# EAGLE design heatbed (EAGLE 6.5.0)
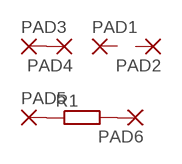
[diagram p0: schematic, sheet 1]

## Parts
PAD1  SMD5  [SMD2,54-5,08]
PAD2  SMD5  [SMD2,54-5,08]
PAD3  SMD5  [SMD2,54-5,08]
PAD4  SMD5  [SMD2,54-5,08]
PAD5  SMD5  [SMD2,54-5,08]
PAD6  SMD5  [SMD2,54-5,08]
R1  R-EU_R0805  [R0805]

## Nets
N$1: PAD5.1(P) R1.1
N$2: PAD6.1(P) R1.2
N$3: PAD3.1(P) PAD4.1(P)
Unconnected: PAD1.1(P) PAD2.1(P)

## Library data of the parts
PAD1-PAD6 = wirepad:SMD5: SMD PAD
R1 = rcl:R-EU_: RESISTOR, European symbol

## Board
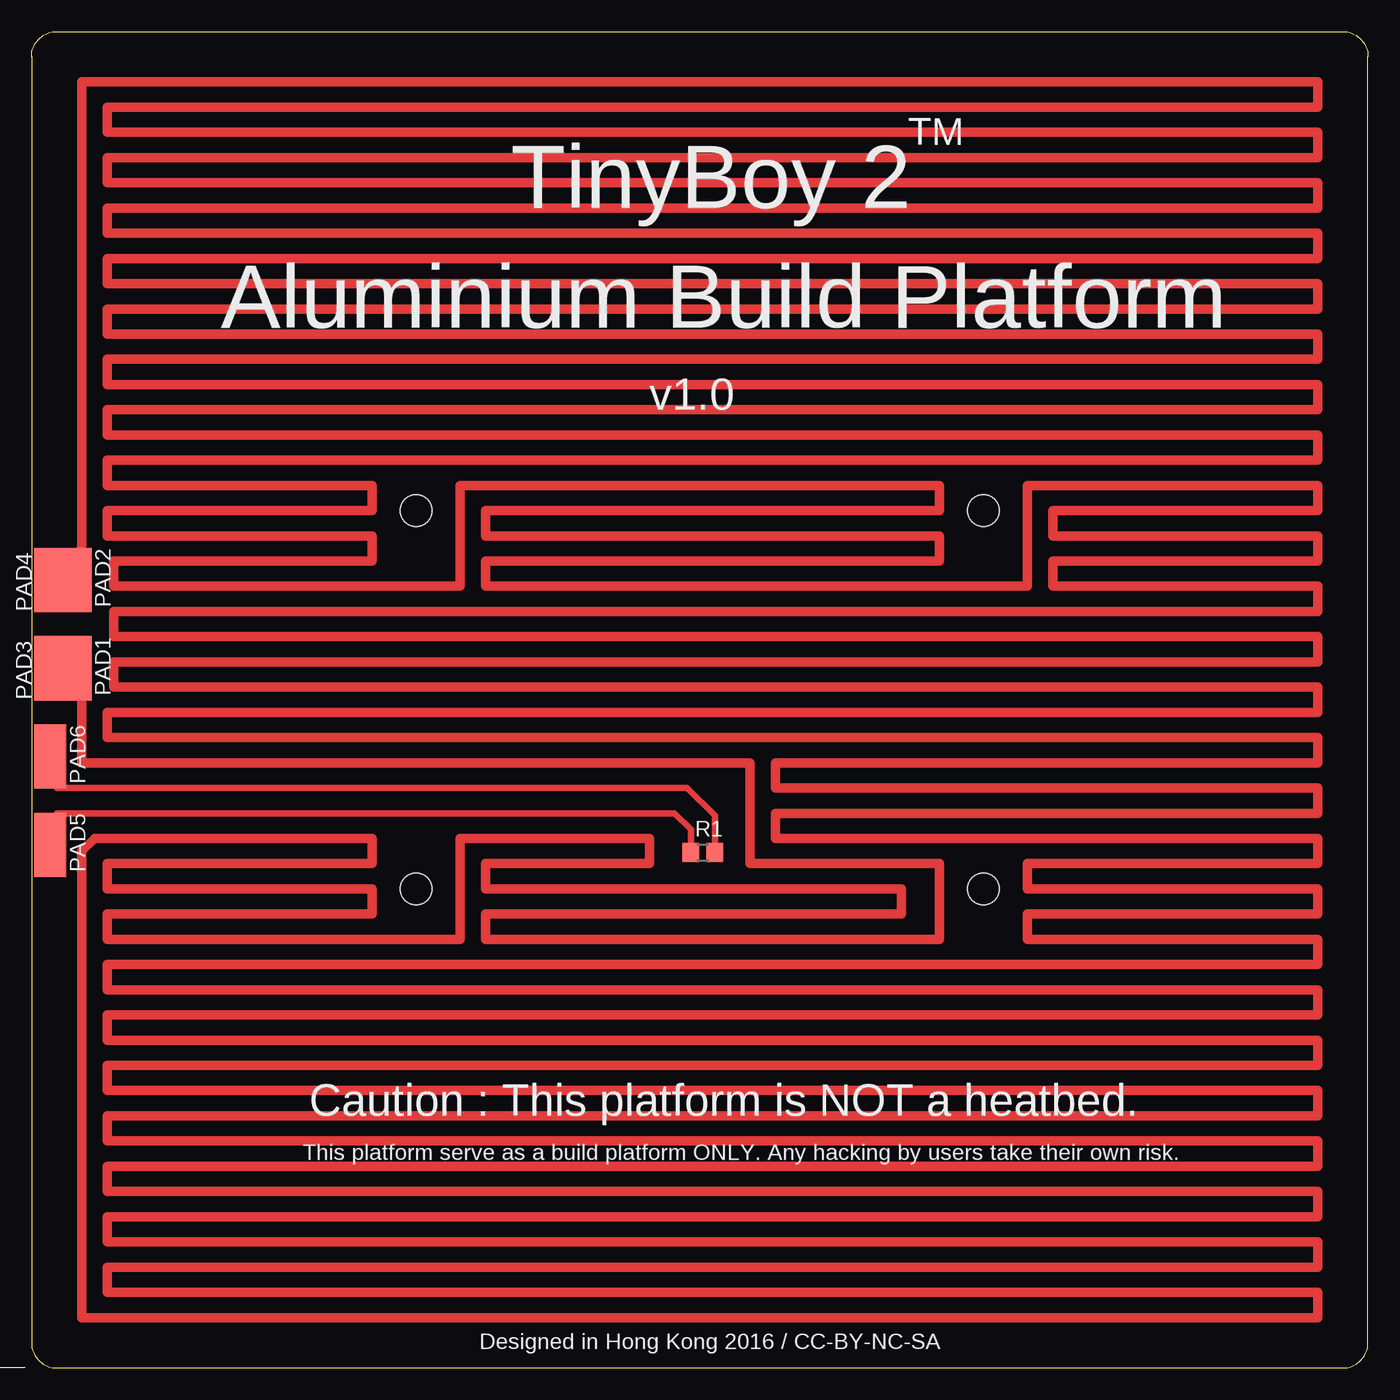
[diagram p1: board, top side]

Size 106 x 106 mm. Coordinates in mm from the lower left corner, seen from the top.
Outline: 0,104 0,2 arc90 2,0 104,0 arc90 106,2 106,104 arc90 104,106 2,106 arc90 0,104
Copper layers (1*16): Top 0.035mm / dielectric 1.5mm / Bottom 0.035mm
Design rules "default": minimum track width 10mil, minimum drill 24mil, track to track 8mil, track to pad 8mil, pad to pad 8mil, via to via 8mil, smd to smd 8mil, copper to edge 40mil, drill to drill 8mil, minimum pad ring 10mil, minimum via ring 8mil, stop-mask expansion 4mil, vias tented up to drill 0mil, thermal gap 10mil
Holes 2.5 mm at 30.5,68 75.5,68 75.5,38 30.5,38

### Footprints (pad centres in the part's own frame; a part is rotated, then mirrored left to right if it is on the bottom)
SMD2,54-5,08 = smd 2.54 x 5.08: 1 0,0
R0805 = smd 1.3 x 1.5: 1 -0.95,0; 2 0.95,0

### Placement (x,y rotation side)
PAD1  3.5,55.5 180 top
PAD2  3.5,62.5 180 top
PAD3  1.5,55.5 0 top
PAD4  1.5,62.5 0 top
PAD5  1.5,41.5 180 top
PAD6  1.5,48.5 180 top
R1  53.24,40.89 0 top

### Tracks (layer width: path | path; a pad name or v marks a point on that pad's centre or on a via)
N$1
  Top 0.5: R1.1 52.29,42.71 51,44 2,44 2,41 PAD5.1
N$2
  Top 0.5: R1.2 54.19,43.81 52,46 2,46 1,47 1,48 PAD6.1
N$3
  Top 0.75: PAD4.1 3.5,62.5 4,63 4,102 102,102 102,100 6,100 6,98 102,98 102,96 6,96 6,94 102,94 102,92 6,92 6,90 102,90 102,88 6,88 6,86 102,86 102,84 6,84 6,82 102,82 102,80 6,80 6,78 102,78 102,76 6,76 6,74 102,74 102,72 6,72 6,70 27,70 27,68 6,68 6,66 27,66 27,64 6.5,64 6.5,62 34,62 34,70 72,70 72,68 36,68 36,66 72,66 72,64 36,64 36,62 79,62 79,70 102,70 102,68 81,68 81,66 102,66 102,64 81,64 81,62 102,62 102,60 6.5,60 6.5,58 102,58 102,56 6.5,56 6.5,54 102,54 102,52 6,52 6,50 102,50 102,48 59,48 59,46 102,46 102,44 59,44 59,42 102,42 102,40 79,40 79,38 102,38 102,36 79,36 79,34 102,34 102,32 6,32 6,30 102,30 102,28 6,28 6,26 102,26 102,24 6,24 6,22 102,22 102,20 6,20 6,18 102,18 102,16 6,16 6,14 102,14 102,12 6,12 6,10 102,10 102,8 6,8 6,6 102,6 102,4 4,4 4,41 5,42 27,42 27,40 6,40 6,38 27,38 27,36 6,36 6,34 34,34 34,42 49,42 49,40 36,40 36,38 69,38 69,36 36,36 36,34 72,34 72,40 57,40 57,48 4,48 4,55 3.5,55.5 PAD3.1

### Text on the board
tNames: TM | TinyBoy 2 | Aluminium Build Platform | v1.0 | Caution : This platform is NOT a heatbed. | This platform serve as a build platform ONLY. Any hacking by users take their own risk. | Designed in Hong Kong 2016 / CC-BY-NC-SA